# EAGLE design board_breakout (EAGLE 6.5.0)
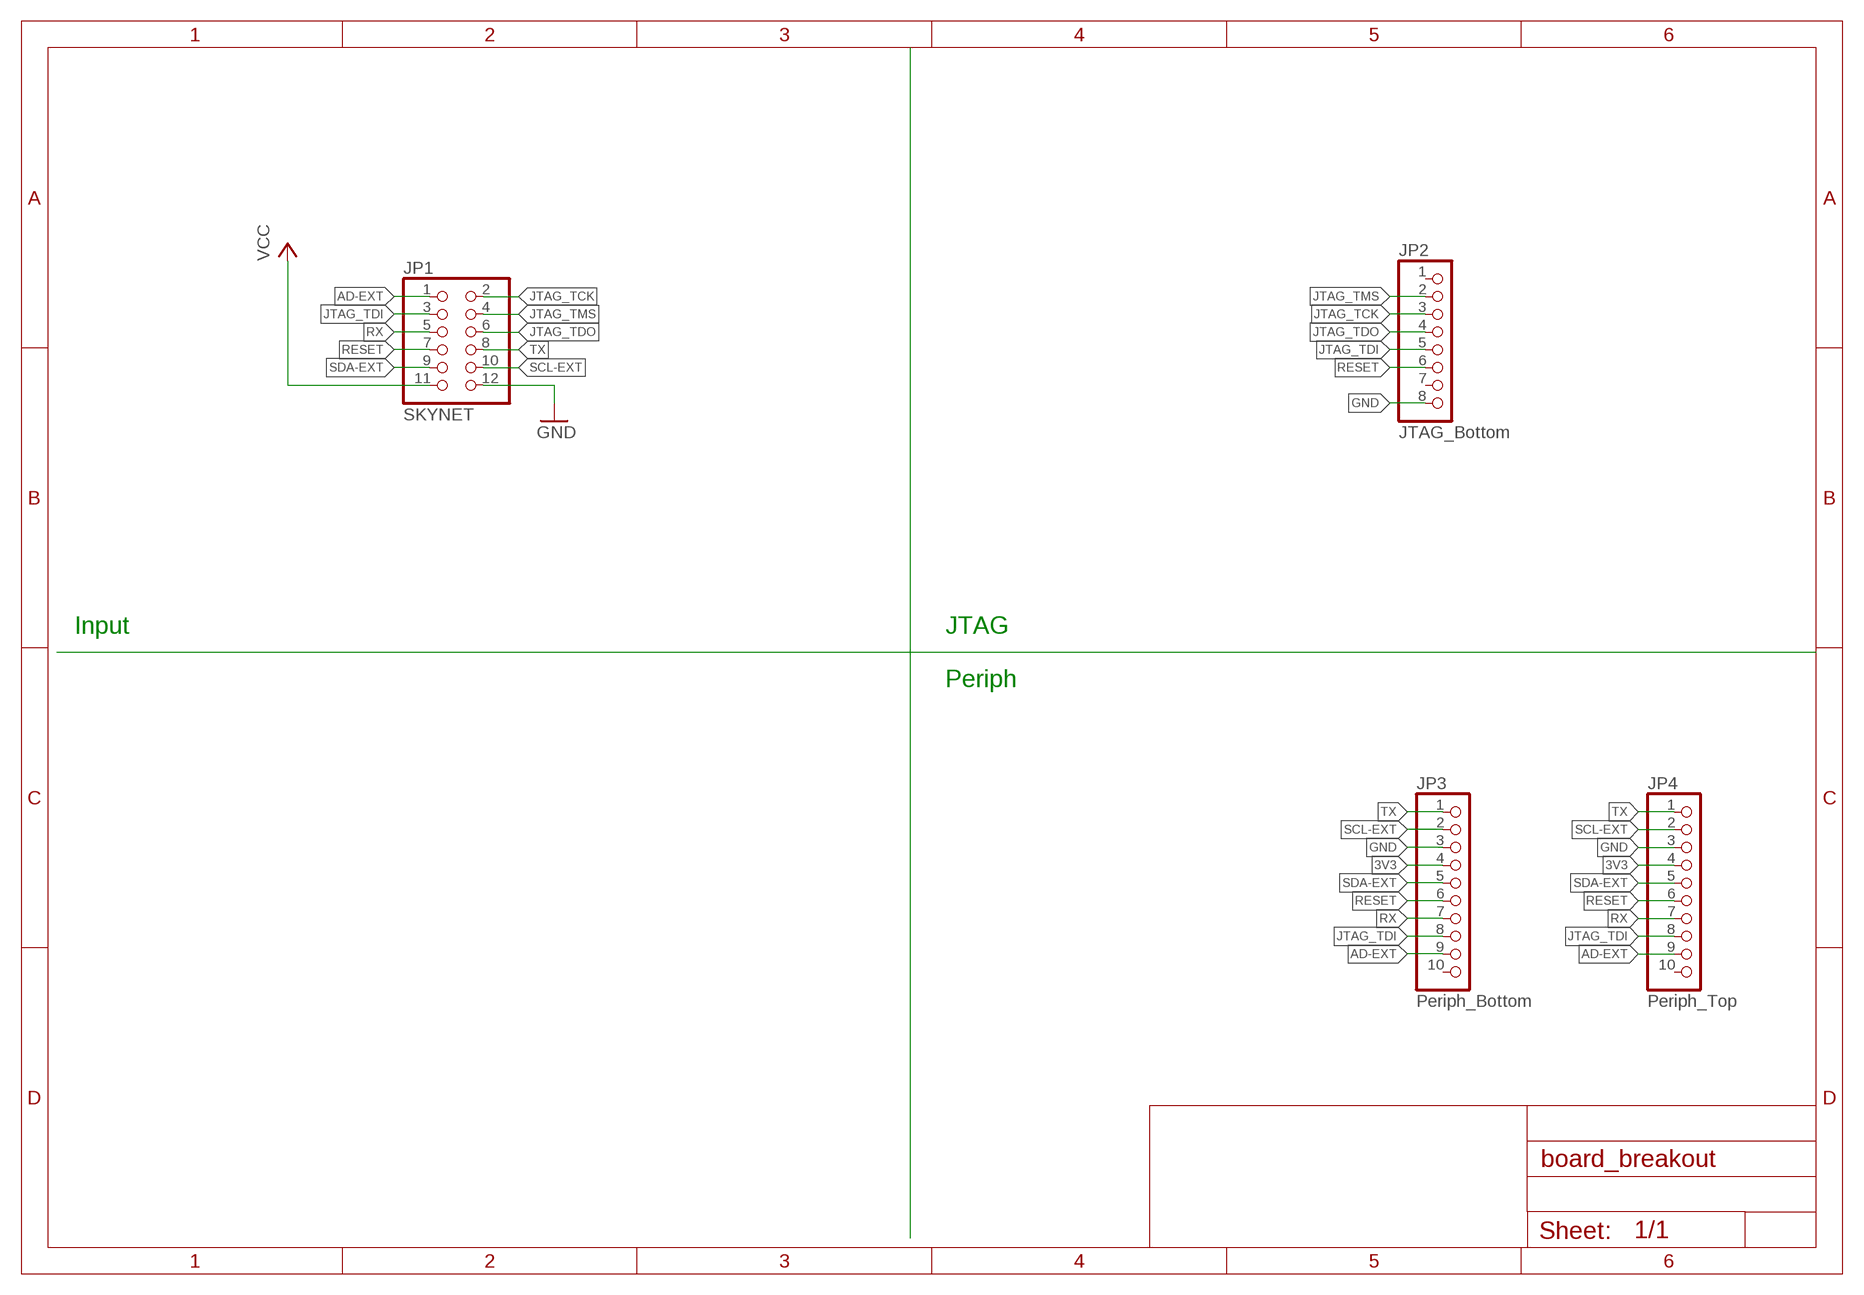
[diagram p0: schematic, sheet 1]

## Parts
JP1  SKYNET  PINHD-2X6M  [2X06M]
JP2  JTAG_Bottom  PINHD-1X8  [1X08]
JP3  Periph_Bottom  PINHD-1X10  [1X10]
JP4  Periph_Top  HEADER-1X10SMT  [1X10_SMT]

## Nets
3V3: JP1.11 JP3.4 JP4.4 ; supply symbol labelled VCC
AD-EXT: JP1.1 JP3.9 JP4.9
GND: JP1.12 JP2.8 JP3.3 JP4.3
JTAG_TCK: JP1.2 JP2.3
JTAG_TDI: JP1.3 JP2.5 JP3.8 JP4.8
JTAG_TDO: JP1.6 JP2.4
JTAG_TMS: JP1.4 JP2.2
RESET: JP1.7 JP2.6 JP3.6 JP4.6
RX: JP1.5 JP3.7 JP4.7
SCL-EXT: JP1.10 JP3.2 JP4.2
SDA-EXT: JP1.9 JP3.5 JP4.5
TX: JP1.8 JP3.1 JP4.1
Unconnected: JP2.1 JP2.7 JP3.10 JP4.10

## Notes on the sheet
- Input | JTAG
- Periph

## Library data of the parts
JP1 = pinhead:PINHD-2X6: PIN HEADER
JP2 = pinhead:PINHD-1X8: PIN HEADER
JP3 = pinhead:PINHD-1X10: PIN HEADER
JP4 = microbuilder:HEADER-1X10: PIN HEADER

## Board
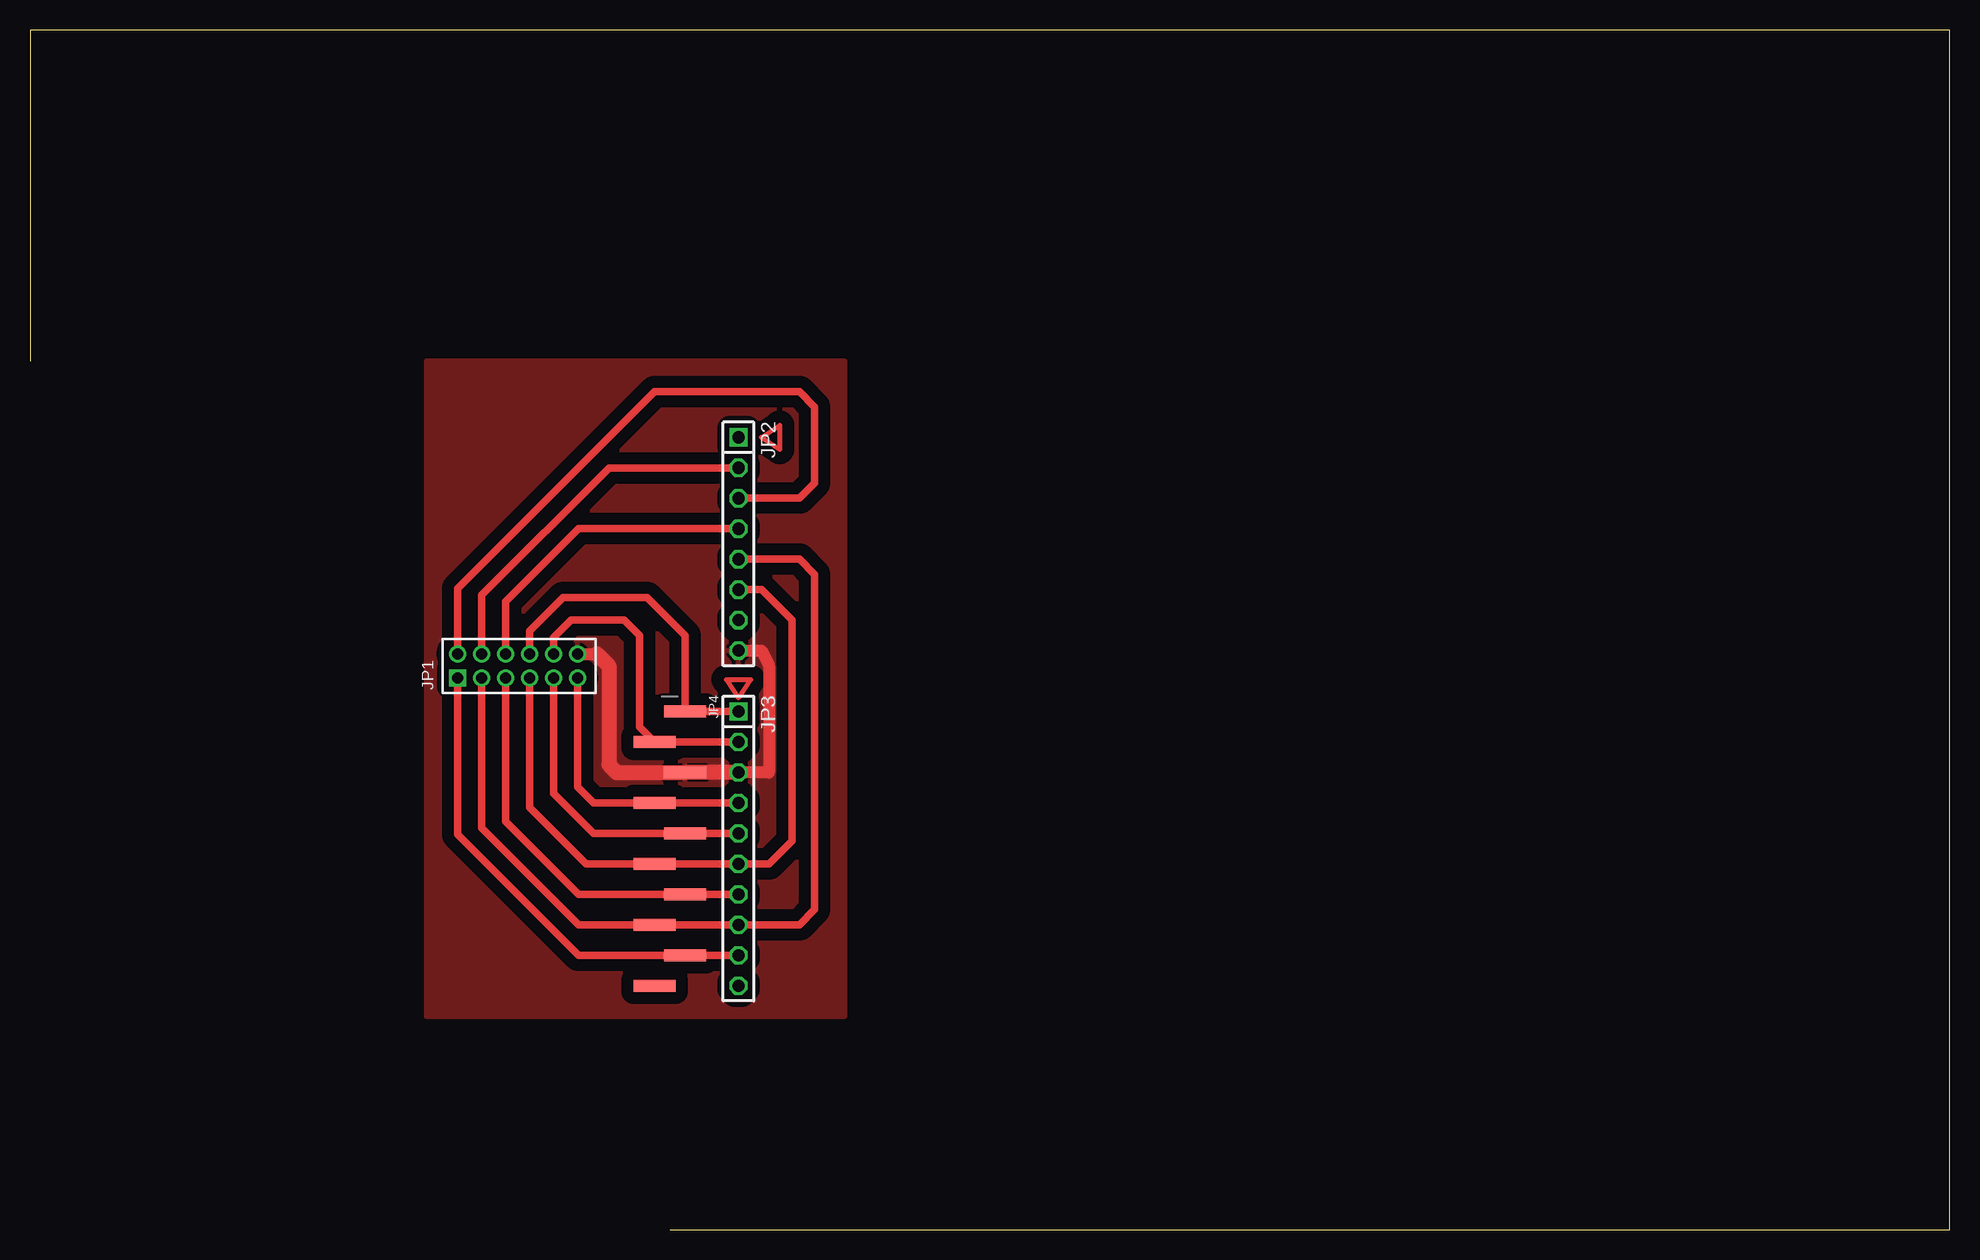
[diagram p1: board, top side]

Size 160 x 100 mm. Coordinates in mm from the lower left corner, seen from the top.
Outline: 53.34,0 160,0 160,100 0,100 0,72.39
Copper layers (1*16): Top 0.035mm / dielectric 1.5mm / Bottom 0.035mm
Design rules "default *": minimum track width 10mil, minimum drill 24mil, track to track 12mil, track to pad 12mil, pad to pad 12mil, via to via 12mil, smd to smd 12mil, copper to edge 40mil, drill to drill 12mil, minimum pad ring 10mil, minimum via ring 8mil, stop-mask expansion 4mil, vias tented up to drill 0mil, thermal gap 10mil

### Footprints (pad centres in the part's own frame; a part is rotated, then mirrored left to right if it is on the bottom)
2X06M = drill 0.914 square: 1 -5,-1 | drill 0.914: 2 -5,1; 3 -3,-1; 4 -3,1; 5 -1,-1; 6 -1,1; 7 1,-1; 8 1,1; 9 3,-1; 10 3,1; 11 5,-1; 12 5,1
1X08 = drill 1.016 square: 1 -8.89,0 | drill 1.016 octagon: 2 -6.35,0; 3 -3.81,0; 4 -1.27,0; 5 1.27,0; 6 3.81,0; 7 6.35,0; 8 8.89,0
1X10 = drill 1.016 square: 1 -11.43,0 | drill 1.016 octagon: 2 -8.89,0; 3 -6.35,0; 4 -3.81,0; 5 -1.27,0; 6 1.27,0; 7 3.81,0; 8 6.35,0; 9 8.89,0; 10 11.43,0
1X10_SMT = smd 1 x 3.5: 1 -11.43,1.27; 2 -8.89,-1.27; 3 -6.35,1.27; 4 -3.81,-1.27; 5 -1.27,1.27; 6 1.27,-1.27; 7 3.81,1.27; 8 6.35,-1.27; 9 8.89,1.27; 10 11.43,-1.27

### Placement (x,y rotation side)
JP1  40.64,46.99 0 top
JP2  59.05,57.15 270 top
JP3  59.05,31.75 270 top
JP4  53.34,31.75 270 top

### Tracks (layer width: path | path; a pad name or v marks a point on that pad's centre or on a via)
3V3
  Top 0.61: JP3.4 JP4.4 46.99,35.56 45.64,36.91 JP1.11
AD-EXT
  Top 0.61: JP1.1 35.64,32.94 45.72,22.86 JP4.9 JP3.9
GND
  Top 1.016: JP2.8 60.96,48.26 61.59,46.99 61.59,38.1 JP3.3 | JP1.12 47.26,47.99
  Top 1.27: JP3.3 JP4.3 48.9,38.1 48.26,38.73 48.26,46.99 47.26,47.99
  pour Top (isolate 1.016): 33.02,72.39 33.02,17.78 67.94,17.78 67.94,72.39
JTAG_TCK
  Top 0.61: JP1.2 35.64,53.42 52.07,69.85 64.14,69.85 65.41,68.58 65.41,62.23 64.14,60.96 JP2.3
JTAG_TDI
  Top 0.61: JP1.3 37.64,33.48 45.72,25.4 JP4.8 JP3.8 64.14,25.4 65.41,26.67 65.41,54.61 64.14,55.88 JP2.5
JTAG_TDO
  Top 0.61: JP1.6 39.64,52.34 45.72,58.42 JP2.4
JTAG_TMS
  Top 0.61: JP1.4 37.64,52.88 48.26,63.5 JP2.2
N$1
  Top 0.406: 62.48,67.06 62.48,65.02 60.96,66.04 62.36,66.93
N$2
  Top 0.406: 58.04,45.85 60.07,45.85 59.05,44.32 58.17,45.72
RESET
  Top 0.61: JP1.7 41.64,35.2 46.35,30.48 JP4.6 JP3.6 61.59,30.48 63.5,32.38 63.5,50.8 60.96,53.34 JP2.6
RX
  Top 0.61: JP1.5 39.64,34.02 45.72,27.94 JP4.7 JP3.7
SCL-EXT
  Top 0.61: JP1.10 43.64,49.35 45.09,50.8 49.53,50.8 50.8,49.53 50.8,41.91 JP4.2 JP3.2
SDA-EXT
  Top 0.61: JP1.9 43.64,36.37 46.99,33.02 JP4.5 JP3.5
TX
  Top 0.61: JP1.8 41.64,49.9 44.45,52.7 51.44,52.7 54.61,49.53 JP4.1 JP3.1